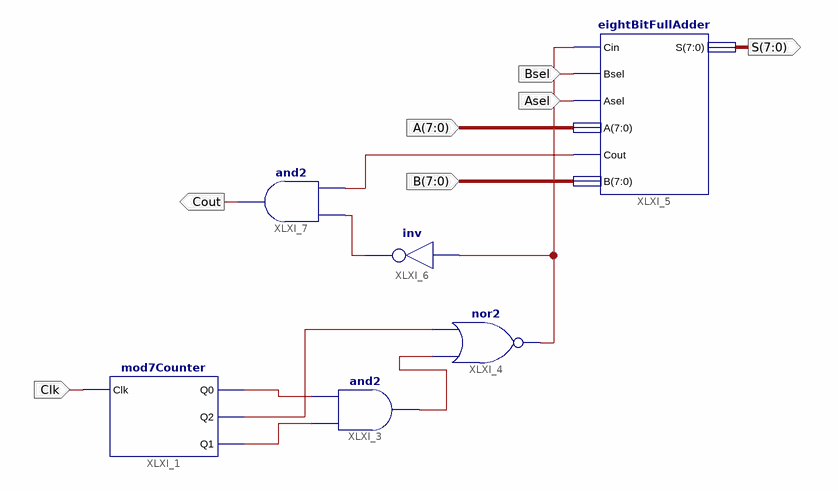
[diagram p0: schematic sheet 1]
// Xilinx ISE schematic first_a.sch (spartan3) as structural Verilog: 6 symbols, 7 ports
module first_a (
  input  Clk,
  input  [7:0] A,
  input  [7:0] B,
  input  Bsel,
  input  Asel,
  output [7:0] S,
  output Cout
);

  wire XLXN_3, XLXN_4, XLXN_5, XLXN_6, XLXN_8, XLXN_15, XLXN_16;

  mod7Counter XLXI_1 (.Clk(Clk), .Q0(XLXN_3), .Q2(XLXN_5), .Q1(XLXN_4));
  and XLXI_3 (XLXN_6, XLXN_4, XLXN_3);
  nor XLXI_4 (XLXN_8, XLXN_6, XLXN_5);
  eightBitFullAdder XLXI_5 (.Cin(XLXN_8), .Bsel(Bsel), .Asel(Asel), .A(A), .B(B), .Cout(XLXN_15), .S(S));
  not XLXI_6 (XLXN_16, XLXN_8);
  and XLXI_7 (Cout, XLXN_15, XLXN_16);
endmodule
